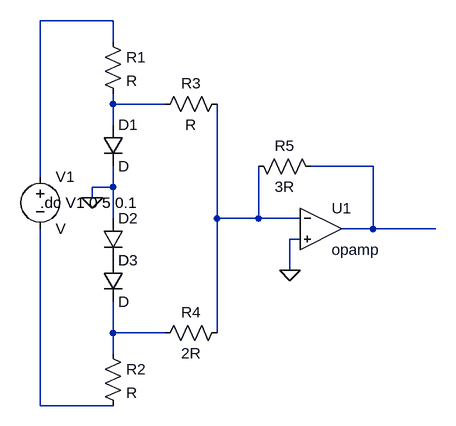
[diagram p0: schematic output_signal_circuit.asc]
output_signal_circuit.asc, the LTspice schematic file:
Version 4.1
SHEET 1 880 680
WIRE 112 -352 0 -352
WIRE 112 -320 112 -352
WIRE 112 -224 112 -240
WIRE 192 -224 112 -224
WIRE 112 -192 112 -224
WIRE 512 -128 416 -128
WIRE 0 -112 0 -352
WIRE 112 -96 112 -128
WIRE 112 -96 80 -96
WIRE 80 -80 80 -96
WIRE 112 -48 112 -96
WIRE 272 -48 272 -224
WIRE 336 -48 336 -128
WIRE 336 -48 272 -48
WIRE 400 -48 336 -48
WIRE 512 -32 512 -128
WIRE 512 -32 464 -32
WIRE 608 -32 512 -32
WIRE 400 -16 384 -16
WIRE 384 32 384 -16
WIRE 112 128 112 80
WIRE 192 128 112 128
WIRE 272 128 272 -48
WIRE 112 160 112 128
WIRE 0 240 0 -32
WIRE 112 240 0 240
FLAG 80 -80 0
FLAG 384 32 0
SYMBOL diode 96 -192 R0
SYMATTR InstName D1
SYMBOL res 96 -336 R0
SYMATTR InstName R1
SYMBOL diode 96 -48 R0
SYMATTR InstName D2
SYMBOL diode 96 16 R0
SYMATTR InstName D3
SYMBOL res 96 144 R0
SYMATTR InstName R2
SYMBOL voltage 0 -128 R0
SYMATTR InstName V1
SYMBOL OpAmps\\opamp 432 -96 R0
SYMATTR InstName U1
SYMBOL res 288 -240 R90
WINDOW 0 0 56 VBottom 2
WINDOW 3 32 56 VTop 2
SYMATTR InstName R3
SYMBOL res 288 112 R90
WINDOW 0 0 56 VBottom 2
WINDOW 3 32 56 VTop 2
SYMATTR InstName R4
SYMATTR Value 2R
SYMBOL res 320 -144 M90
WINDOW 0 0 56 VBottom 2
WINDOW 3 32 56 VTop 2
SYMATTR InstName R5
SYMATTR Value 3R
TEXT 0 -72 Left 2 !.dc V1 0 5 0.1

The netlist it stands for:
* output_signal_circuit.asc
D1 N002 0 D
R1 N001 N002 R
D2 0 P001 D
D3 P001 N005 D
R2 N005 N006 R
V1 N001 N006 V
X§U1 N004 0 N003 opamp Aol=100K GBW=10Meg  ; pins invin noninvin out
R3 N004 N002 R
R4 N004 N005 2R
R5 N004 N003 3R
.model D D
.lib standard.dio
.dc V1 0 5 0.1
.backanno
.end